# Altium schematic sheet FUEL GAUGE IC.SchDoc
size A4; SheetNumber: 7; SheetTotal: 8
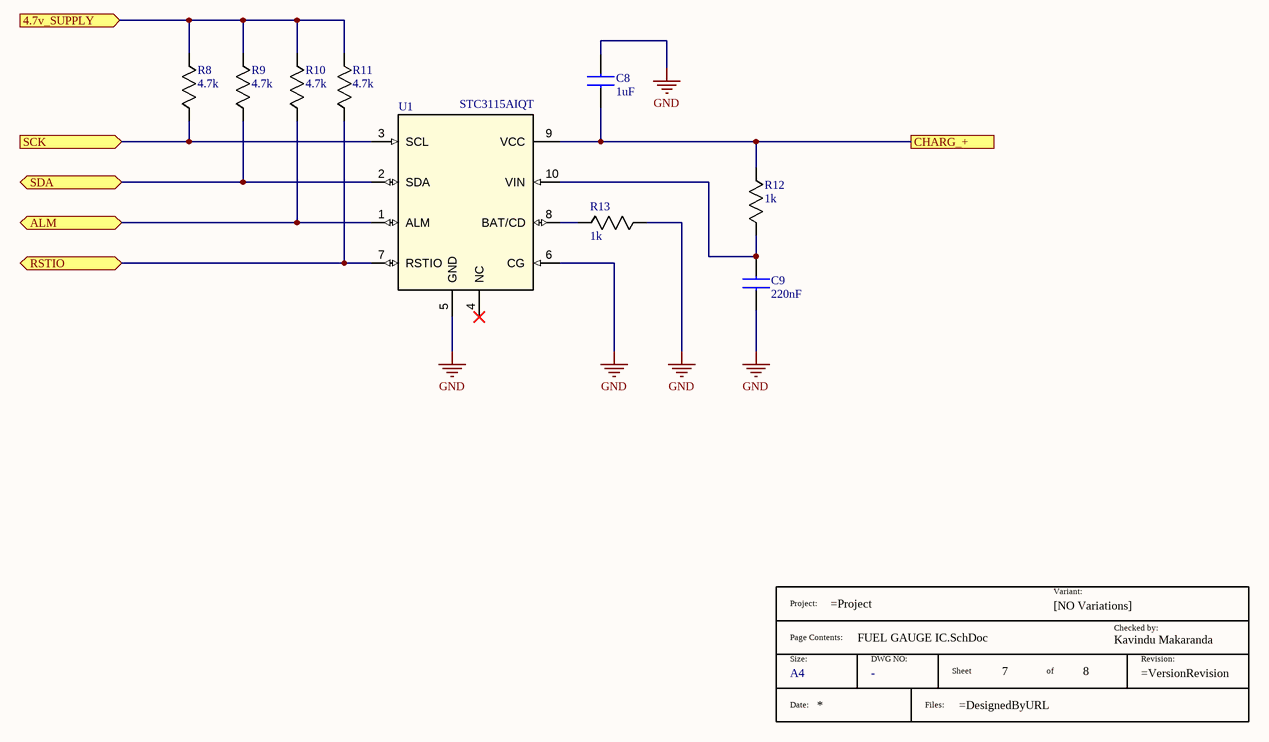
[diagram p0: FUEL GAUGE IC.SchDoc]

## Parts
*?  Size: A4  (hidden comment: TitleBlock)  (graphical)
C8  1uF  [CAPC1608X90N]
C9  220nF  [C0603]
R8  4.7k  [RESC1608X55N]
R9  4.7k  [RESC1608X55N]
R10  4.7k  [RESC1608X55N]
R11  4.7k  [RESC1608X55N]
R12  1k  [RESC1608X55N]
R13  1k  [RESC1608X55N]
U1  STC3115AIQT  [DFN10_2X3_STM]

## Ports
4.7v_SUPPLY (in, see Main_sch[3C], DISPLAY[2C], MCU[3A], VOLTAGE REGULATOR[3B]), ALM (bidir, see Main_sch[3B], MCU[3B]), CHARG_+ (see Main_sch[3B], BATTERY[2B], CHARGING IC[4B]), RSTIO (bidir, see Main_sch[3B], MCU[3B]), SCK (in, see Main_sch[3C], DISPLAY[2B], MCU[1B]), SDA (bidir, see Main_sch[3C], DISPLAY[2B], MCU[1B])

## Nets
GND: C8.2 C9.1 R13.2 U1.5(GND) U1.6(CG)
4.7v_SUPPLY: R8.2 R9.2 R10.2 R11.2 ; port 4.7v_SUPPLY
ALM: R10.1 U1.1(ALM) ; port ALM
CHARG_+: C8.1 R12.2 U1.9(VCC) ; port CHARG_+
RSTIO: R11.1 U1.7(RSTIO) ; port RSTIO
SCK: R8.1 U1.3(SCL) ; port SCK
SDA: R9.1 U1.2(SDA) ; port SDA
NetC9_2: C9.2 R12.1 U1.10(VIN)
NetR13_1: R13.1 U1.8(BAT/CD)

Not connected (* = marked no-connect by the designer): U1 4(NC)*

## Notes on the sheet
- THIS DOCUMENT AND THE DATA DISCLOSED HEREIN OR
- HEREWITH IS THE PROPERTY OF ALTIUM LIMITED AND MAY
- DWG NO:
- REVISION
- REV:
- DESCRIPTION
- DATE
- APPROVED
- BE FREELY DISTRIBUTED IN WHOLE. NO RIGHTS ARE
- RESERVED OR EXPRESS OR IMPLIED WARANTEE GIVEN.
- ENG:
- APPROVALS
- PROJECT
- DSN:
- CHK:
- REFERENCE DOCUMENTS
- PROJECT REVISION:
- TITLE
- DOCUMENT REVISION:
- DESIGN ITEM:
- BOM:
- FAB DWG:
- PCB DWG:
- ASSY DWG:
- SCALE:
- A3
- SIZE
- CAGE CODE
- FILE NAME
- DWG NO.
- SHEET
- OF
- REV
- (in symbol TitleBlock) Project:; Variant:; [NO Variations]; Checked by:; Page Contents:; Kavindu Makaranda; Size:; DWG NO:; Sheet; of; Revision:; Date:; Files:

## Library data of the parts
*? = TitleBlock: Standard Title Block; DWG NO: -
C8 = CL10A105KO8NNNC: Manufacturer_Name: SAMSUNG; Datasheet Link: https://labcenter.componentsearchengine.com/Datasheets/2/CL10A105KO8NNNC.pdf; Height: 0.9mm; Manufacturer_Part_Number: CL10A105KO8NNNC; Mouser Part Number: 187-CL10A105KO8NNNC; Mouser Price/Stock: https://www.mouser.co.uk/ProductDetail/Samsung-Electro-Mechanics/CL10A105KO8NNNC?qs=hqM3L16%252BxlfR4qamq4FMLg%3D%3D; Arrow Part Number: CL10A105KO8NNNC; Arrow Price/Stock: https://www.arrow.com/en/products/cl10a105ko8nnnc/samsung-electro-mechanics?utm_currency=USD&region=nac; Supplier 1: Digikey; Supplier Part Number 1: 1276-1034-1-ND
C9 = C0603C224K4RECAUTO: Capacitor C0603C224K4RECAUTO; Manufacturer_Name: KEMET; Datasheet Link: https://content.kemet.com/datasheets/KEM_C1090_X7R_ESD.pdf; Height: 0.87mm; Manufacturer_Part_Number: C0603C224K4RECAUTO; Mouser Part Number: 80-C0603C224K4RECAUT; Mouser Price/Stock: https://www.mouser.co.uk/ProductDetail/KEMET/C0603C224K4RECAUTO?qs=MLItCLRbWszB36u3S8vAZQ%3D%3D; Arrow Part Number: C0603C224K4RECAUTO; Arrow Price/Stock: https://www.arrow.com/en/products/c0603c224k4recauto/kemet-corporation?region=nac; Supplier 1: Arrow Electronics; Supplier Part Number 1: C0603C224K4RECAUTO
R8-R11 = RC0603FR-074K7L: Resistor RC0603FR-074K7L; Manufacturer_Name: YAGEO; Datasheet Link: https://componentsearchengine.com/Datasheets/2/RC0603FR-074K7L.pdf; Height: 0.55mm; Manufacturer_Part_Number: RC0603FR-074K7L; Mouser Part Number: 603-RC0603FR-074K7L; Mouser Price/Stock: https://www.mouser.co.uk/ProductDetail/YAGEO/RC0603FR-074K7L?qs=gt6vzsuosg37y0l7Vt36bQ%3D%3D; Arrow Part Number: RC0603FR-074K7L; Arrow Price/Stock: https://www.arrow.com/en/products/rc0603fr-074k7l/yageo?utm_currency=USD&region=europe; Supplier 1: Future Electronics; Supplier Part Number 1: 5489695
R12 R13 = RMCF0603FT1K00: Manufacturer_Name: Stackpole Electronics; Datasheet Link: https://www.seielect.com/Catalog/SEI-RMCF_RMCP.pdf; Height: 0.55mm; Manufacturer_Part_Number: RMCF0603FT1K00; Mouser Part Number: 708-RMCF0603FT1K00; Mouser Price/Stock: https://www.mouser.co.uk/ProductDetail/SEI-Stackpole/RMCF0603FT1K00?qs=FESYatJ8odI%252BYiPlprc1Pg%3D%3D; Arrow Part Number: RMCF0603FT1K00; Arrow Price/Stock: https://www.arrow.com/en/products/rmcf0603ft1k00/stackpole-electronics?utm_currency=USD&region=nac; Supplier 1: Digikey; Supplier Part Number 1: RMCF0603FT1K00CT-ND
U1 = STC3115AIQT: STC3115AIQT Fuel Gauge IC; Mfr_Name: STMicroelectronics; RefDes: RefDes; Type: Type; Supplier 1: Arrow Electronics; Supplier Part Number 1: STC3115AIQT